# Altium schematic sheet CZ201C_V2.0.SchDoc
size A4
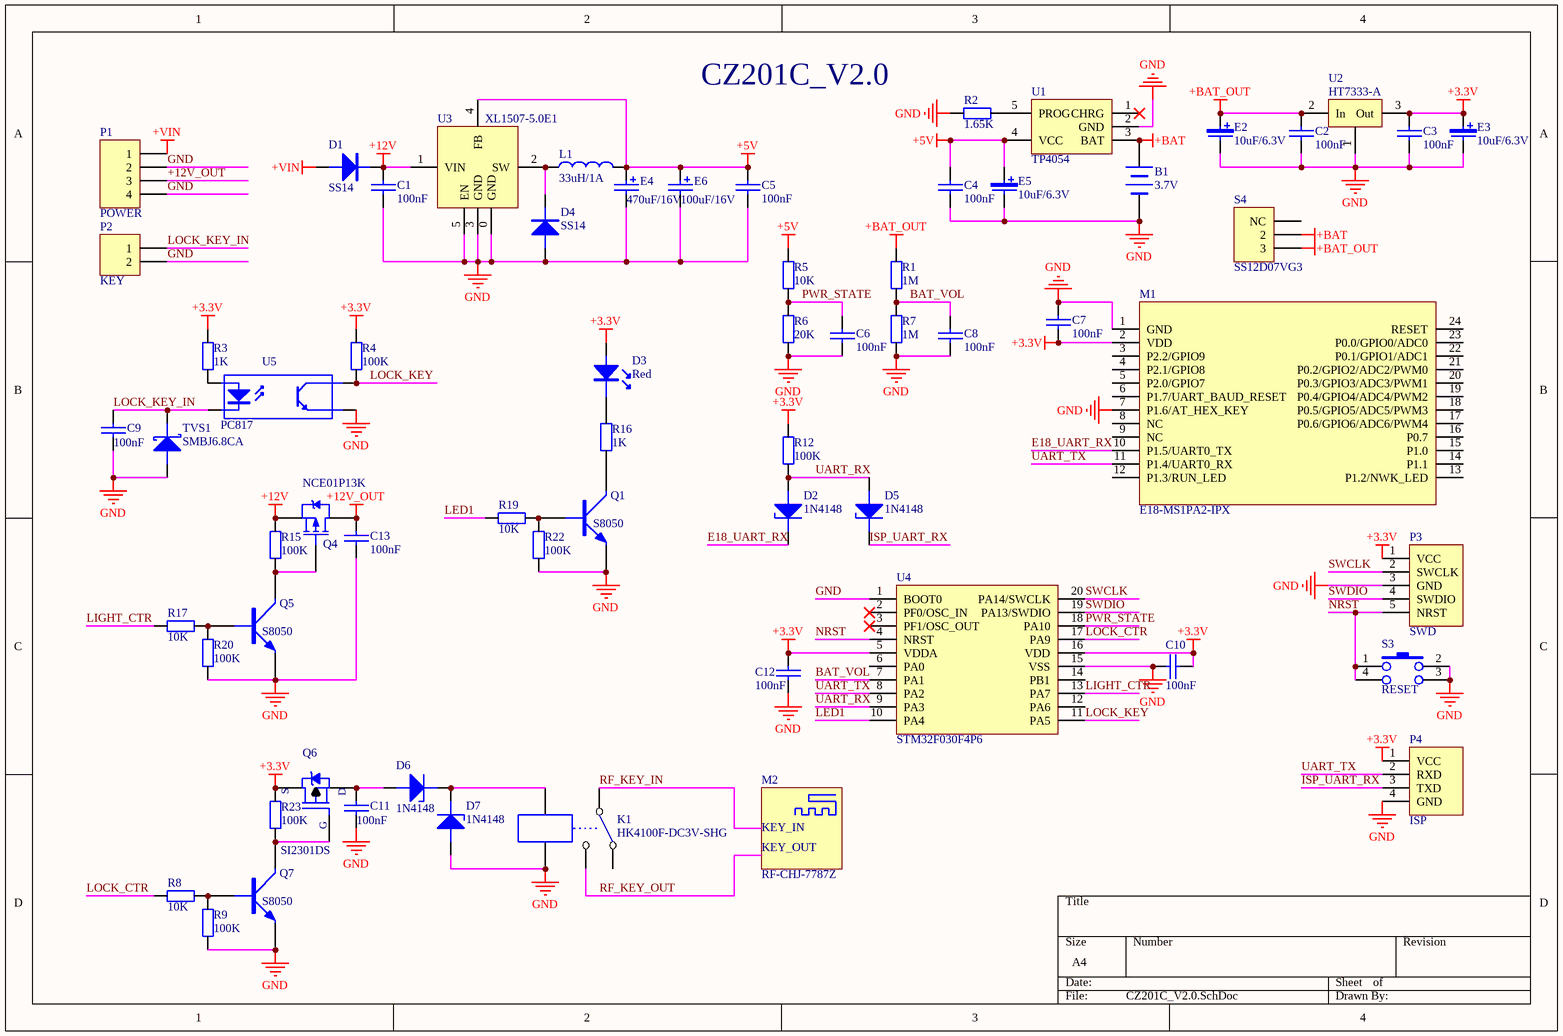
[diagram p0: CZ201C_V2.0.SchDoc]

## Parts
B1  3.7V  [XH2.54-2P-BAT]
C1  100nF  [0603_CN]
C2  100nF  [0603_CN]
C3  100nF  [0603_CN]
C4  100nF  [0603_CN]
C5  100nF  [0603_CN]
C6  100nF  [0603_CN]
C7  100nF  [0603_CN]
C8  100nF  [0603_CN]
C9  100nF  [0603_CN]
C10  100nF  [0603_CN]
C11  100nF  [0603_CN]
C12  100nF  [0603_CN]
C13  100nF  [0603_CN]
D1  SS14  [DO-214AC(SMA)]
D2  1N4148  [LL-34]
D3  Red  [0603_LED]
D4  SS14  [DO-214AC(SMA)]
D5  1N4148  [LL-34]
D6  1N4148  [LL-34]
D7  1N4148  [LL-34]
E2  10uF/6.3V  [3216_E]
E3  10uF/6.3V  [3216_E]
E4  470uF/16V  [CS_470uF/16V]
E5  10uF/6.3V  [3216_E]
E6  100uF/16V  [CS_100uF/16V]
K1  HK4100F-DC3V-SHG  [HK4100-DC5V-SHG]
L1  33uH/1A  [CDRH74]
M1  E18-MS1PA2-IPX  [E18-MS1PA2-IPX]
M2  RF-CHJ-7787Z  [RF-CHJ-7787Z]
P1  POWER  [KF3.5-4P]
P2  KEY  [KF3.5-2P]
P3  SWD  [XH2.54-5P]
P4  ISP  [XH2.54-4P]
Q1  S8050  [SOT-23]
Q4  NCE01P13K  [TO-252]
Q5  S8050  [SOT-23]
Q6  SI2301DS  [SOT-23]
Q7  S8050  [SOT-23]
R1  1M  [0603_RN]
R2  1.65K  [0603_RN]
R3  1K  [0603_RN]
R4  100K  [0603_RN]
R5  10K  [0603_RN]
R6  20K  [0603_RN]
R7  1M  [0603_RN]
R8  10K  [0603_RN]
R9  100K  [0603_RN]
R12  100K  [0603_RN]
R15  100K  [0603_RN]
R16  1K  [0603_RN]
R17  10K  [0603_RN]
R19  10K  [0603_RN]
R20  100K  [0603_RN]
R22  100K  [0603_RN]
R23  100K  [0603_RN]
S3  RESET  [KEY-6*6MM-DIP]
S4  SS12D07VG3  [SS-12D07G3]
TVS1  SMBJ6.8CA  [DO-214AA(SMB)]
U1  TP4054  [SOT-23-5]
U2  HT7333-A  [SOT-89]
U3  XL1507-5.0E1  [TO-252-5]
U4  STM32F030F4P6  [TSSOP20]
U5  PC817  [SOP-4]

## Nets
+3.3V: C3.1 C7.2 C10.1 C12.1 D3.A E3.1 M1.2(VDD) P3.1(VCC) P4.1(VCC) Q6.2(S) R3.2 R4.2 R12.2 R23.2 U2.3(Out) U4.5(VDDA) U4.16(VDD)
+5V: C4.1 C5.1 E4.1 E5.1 E6.1 L1.2 R5.2 U1.4(VCC) U3.4(FB)
+12V: C1.1 D1.K Q4.3(S) R15.2 U3.1(VIN)
+12V_OUT: C13.1 P1.3 Q4.2(D)
+BAT: B1.1(+) S4.2 U1.3(BAT)
+BAT_OUT: C2.1 E2.1 R1.2 S4.3 U2.2(In)
+VIN: D1.A P1.1
GND: B1.2(-) C1.2 C2.2 C3.2 C4.2 C5.2 C6.2 C7.1 C8.2 C9.2 C10.2 C11.2 C12.2 C13.2 D4.A D7.A E2.2 E3.2 E4.2 E5.2 E6.2 K1.5 M1.1(GND) M1.7(P1.6/AT_HEX_KEY) P1.2 P1.4 P2.2 P3.3(GND) P4.4(GND) Q1.2(E) Q5.2(E) Q7.2(E) R2.1 R6.1 R7.1 R9.1 R20.1 R22.1 S3.2 S3.3 TVS1.A U1.2(GND) U2.1(GND) U3.0(GND) U3.3(GND) U3.5(EN) U4.1(BOOT0) U4.15(VSS) U5.3(E)
BAT_VOL: C8.1 R1.1 R7.2 U4.7(PA1)
E18_UART_RX: D2.K M1.10(P1.5/UART0_TX)
ISP_UART_RX: D5.K P4.3(TXD)
LED1: R19.2 U4.10(PA4)
LIGHT_CTR: R17.1 U4.13(PA7)
LOCK_CTR: R8.2 U4.17(PA9)
LOCK_KEY: R4.1 U4.11(PA5) U5.4(C)
LOCK_KEY_IN: C9.1 P2.1 TVS1.K U5.2(K)
NRST: P3.5(NRST) S3.1 S3.4 U4.4(NRST)
PWR_STATE: C6.1 R5.1 R6.2 U4.18(PA10)
RF_KEY_IN: K1.1
RF_KEY_OUT: K1.3
SWCLK: P3.2(SWCLK) U4.20(PA14/SWCLK)
SWDIO: P3.4(SWDIO) U4.19(PA13/SWDIO)
UART_RX: D2.A D5.A R12.1 U4.9(PA3)
UART_TX: M1.11(P1.4/UART0_RX) P4.2(RXD) U4.8(PA2)
NetC11_1: C11.1 D6.A Q6.3(D)
NetD3_K: D3.K R16.2
NetD4_K: D4.K L1.1 U3.2(SW)
NetD6_K: D6.K D7.K K1.4
NetQ1_1: Q1.1(B) R19.1 R22.2
NetQ1_3: Q1.3(C) R16.1
NetQ4_1: Q4.1(G) Q5.3(C) R15.1
NetQ5_1: Q5.1(B) R17.2 R20.2
NetQ6_1: Q6.1(G) Q7.3(C) R23.1
NetQ7_1: Q7.1(B) R8.1 R9.2
NetR2_2: R2.2 U1.5(PROG)
NetR3_1: R3.1 U5.1(A)

Not connected (* = marked no-connect by the designer): K1 2; M1 3(P2.2/GPIO9) 4(P2.1/GPIO8) 5(P2.0/GPIO7) 6(P1.7/UART_BAUD_RESET) 8(NC) 9(NC) 12(P1.3/RUN_LED) 13(P1.2/NWK_LED) 14(P1.1) 15(P1.0) 16(P0.7) 17(P0.6/GPIO6/ADC6/PWM4) 18(P0.5/GPIO5/ADC5/PWM3) 19(P0.4/GPIO4/ADC4/PWM2) 20(P0.3/GPIO3/ADC3/PWM1) 21(P0.2/GPIO2/ADC2/PWM0) 22(P0.1/GPIO1/ADC1) 23(P0.0/GPIO0/ADC0) 24(RESET); S4 1(NC); U1 1(CHRG)*; U4 2(PF0/OSC_IN)* 3(PF1/OSC_OUT)* 6(PA0) 12(PA6) 14(PB1)

## Notes on the sheet
- CZ201C_V2.0
- (in symbol RF-CHJ-7787Z) KEY_IN; KEY_OUT

## Library data of the parts
B1 = BATTERY
C1-C13 = Cap1
D1 D4 = Diode-A
D2 D5-D7 = Diode-B
D3 = LED
E2 E3 E5 = Cap Ta: 0805_E: *; 7361_E: *; 3528_E: *; 7343_E: *; 3216_E: *; 6032_E: *
E4 E6 = Cap Pol1: CS_100uF/16V: D=5mm , PIN Spacing= 2mm; CS_1000uF/16V: D=10mm , PIN Spacing= 3.5mm; CS_470uF/16V: D=8mm , PIN Spacing= 3.5mm; CS_100uF/25V: D=6.3mm , PIN Spacing= 2.5mm; CS_470uF/25V: D=10mm , PIN Spacing= 3.5mm; CS_1000uF/25V: D=10mm , PIN Spacing= 3.5mm; CS_220uF/25V: D=8mm , PIN Spacing= 3.5mm; CS_220uF/16V: D=6.3mm , PIN Spacing= 2.5mm; CS_47uF/25V: D=5mm , PIN Spacing= 2mm
K1 = HK4100F-DC5V-SHG: HK4100-DC5V-SHG,HRS1H-S-DC5V; AC: 250V/3A; DC: 30V/3A
L1 = Inductor: LQH1206: L=3.2mm,W=1.6mm,H=1.8mm; LQH2220: L=5.7mm,W=5mm,H=4.7mm; LQH1812: L=4.5mm,W=3.2mm,H=2.6mm; LQH1210: L=3.2mm,W=2.5mm,H=2mm; SMD1054: L=10mm,W=9mm,H=5.4mm; SMD5845: L=5.8mm,W=5.2mm,H=4.5mm; SMD7850: L=7.8mm,W=7mm,H=5mm; SMD1040: L=10mm,W=9mm,H=4mm; CDRH104: L=10mm,W=10mm,H=4.2mm; CDRH127: L=12mm,W=12mm,H=8mm; CDRH124: L=12mm,W=12mm,H=5mm; SMD7835: L=7.8mm,W=7mm,H=3.5mm; SMD3521: L=3.5mm,W=3.1mm,H=2.1mm; SMD4532: L=4.5mm,W=4mm,H=3.2mm; CDRH125: L=12mm,W=12mm,H=6.2mm; Inductance-8*10: D=8mm,H=10mm; Inductance-6*8: D=6mm,H=8mm; 0402_L: *; 1206_L: *; 0603_L: *; 1210_L: *; 0805_L: *
P1 = Header 4: Header, 4-Pin; LatestRevisionDate: 17-Jul-2002; LatestRevisionNote: Re-released for DXP Platform.; Publisher: Altium Limited
P2 = Header 2: Header, 2-Pin; LatestRevisionDate: 17-Jul-2002; LatestRevisionNote: Re-released for DXP Platform.; Publisher: Altium Limited
P4 = ISP_UART
Q1 Q5 Q7 = 8050
Q4 = PMOS-2: P-Channel Power MOSFET; Note: Pin 4 not drawn and electrically connected to Pin 2.; Published: 8-Jun-2000; LatestRevisionDate: 17-Jul-2002; LatestRevisionNote: Re-released for DXP Platform.; DatasheetDocument: PD-9.390D; PackageReference: TO-220AB; Publisher: Altium Limited; Code_JEDEC: TO-220-AB; ComponentLink1Description: Manufacturer Link; ComponentLink1URL: http://www.irf.com/
Q6 = MOSFET P
R1-R9 R12 R15-R17 R19 R20 R22 R23 = Res1: Name: Resistor; Power: 0210(1/20W 25V), 0402(1/16W  50V),0603(1/16W  50V),0805(1/10W  150V),1206(1/8W  200V),1210(1/4W  200V),1812(1/2W  200V),2010(1/2W  200V),2512(1W  200V),
S3 = SW-4
S4 = SS-12D07G3
TVS1 = Diode-C
U1 = QX4054: TP4054,LTC4054 ,PJ4054MR
U2 = HT7833: HT7533; Output 500mA; Iq: 5uA, max= 7uA
U3 = XL1507